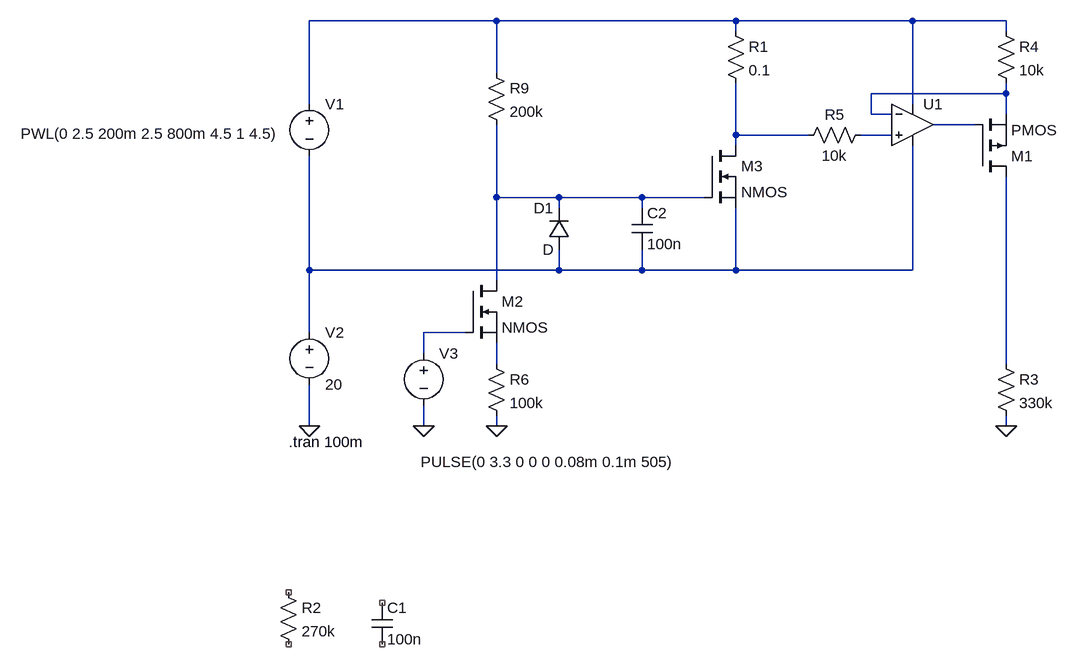
[diagram p0: schematic Balancer_current.asc]
Balancer_current.asc, the LTspice schematic file:
Version 4
SHEET 1 1044 952
WIRE -320 -16 -608 -16
WIRE 48 -16 -320 -16
WIRE 320 -16 48 -16
WIRE 464 -16 320 -16
WIRE 48 0 48 -16
WIRE 464 0 464 -16
WIRE -320 64 -320 -16
WIRE 464 96 464 80
WIRE 464 96 256 96
WIRE -608 112 -608 -16
WIRE 320 112 320 -16
WIRE 256 128 256 96
WIRE 288 128 256 128
WIRE 464 128 464 96
WIRE 416 144 352 144
WIRE 48 160 48 80
WIRE 160 160 48 160
WIRE 288 160 240 160
WIRE 48 176 48 160
WIRE -320 256 -320 144
WIRE -224 256 -320 256
WIRE -96 256 -224 256
WIRE 0 256 -96 256
WIRE -224 272 -224 256
WIRE -96 272 -96 256
WIRE -608 368 -608 192
WIRE -224 368 -224 336
WIRE -224 368 -608 368
WIRE -96 368 -96 336
WIRE -96 368 -224 368
WIRE 48 368 48 272
WIRE 48 368 -96 368
WIRE 320 368 320 176
WIRE 320 368 48 368
WIRE -320 384 -320 256
WIRE -608 464 -608 368
WIRE -368 464 -432 464
WIRE -432 496 -432 464
WIRE -320 512 -320 480
WIRE 464 512 464 224
WIRE -608 608 -608 544
WIRE -432 608 -432 576
WIRE -320 608 -320 592
WIRE 464 608 464 592
FLAG 464 608 0
FLAG -608 608 0
FLAG -320 608 0
FLAG -432 608 0
SYMBOL res 32 -16 R0
SYMATTR InstName R1
SYMATTR Value 0.1
SYMBOL res -656 848 R0
SYMATTR InstName R2
SYMATTR Value 270k
SYMBOL cap -512 880 R0
SYMATTR InstName C1
SYMATTR Value 100n
SYMBOL res 448 496 R0
SYMATTR InstName R3
SYMATTR Value 330k
SYMBOL res 448 -16 R0
SYMATTR InstName R4
SYMATTR Value 10k
SYMBOL OpAmps\\UniversalOpAmp2 320 144 R0
SYMATTR InstName U1
SYMBOL voltage -608 96 R0
WINDOW 3 -444 62 Left 2
WINDOW 123 0 0 Left 0
WINDOW 39 0 0 Left 0
SYMATTR Value PWL(0 2.5 200m 2.5 800m 4.5 1 4.5)
SYMATTR InstName V1
SYMBOL pmos 416 224 M180
SYMATTR InstName M1
SYMBOL voltage -608 448 R0
WINDOW 123 0 0 Left 0
WINDOW 39 0 0 Left 0
SYMATTR InstName V2
SYMATTR Value 20
SYMBOL res 256 144 R90
WINDOW 0 0 56 VBottom 2
WINDOW 3 32 56 VTop 2
SYMATTR InstName R5
SYMATTR Value 10k
SYMBOL cap -112 272 R0
SYMATTR InstName C2
SYMATTR Value 100n
SYMBOL nmos 0 176 R0
SYMATTR InstName M3
SYMBOL diode -208 336 R180
WINDOW 0 24 64 Left 2
WINDOW 3 24 0 Left 2
SYMATTR InstName D1
SYMBOL nmos -368 384 R0
SYMATTR InstName M2
SYMBOL res -336 496 R0
SYMATTR InstName R6
SYMATTR Value 100k
SYMBOL voltage -432 480 R0
WINDOW 3 -5 183 Left 2
WINDOW 123 0 0 Left 0
WINDOW 39 0 0 Left 0
SYMATTR Value PULSE(0 3.3 0 0 0 0.08m 0.1m 505)
SYMATTR InstName V3
SYMBOL res -336 48 R0
SYMATTR InstName R9
SYMATTR Value 200k
TEXT -640 632 Left 2 !.tran 100m

The netlist it stands for:
* Balancer_current.asc
R1 N001 N004 0.1
R2 NC_01 NC_02 270k
C1 NC_03 NC_04 100n
R3 N010 0 330k
R4 N001 N002 10k
XU1 N005 N002 N001 N007 N003 level2 Avol=1Meg GBW=10Meg Slew=10Meg Ilimit=25m Rail=0 Vos=0 En=0 Enk=0 In=0 Ink=0 Rin=500Meg  ; pins In+ In- V+ V- OUT
V1 N001 N007 PWL(0 2.5 200m 2.5 800m 4.5 1 4.5)
M1 N010 N003 N002 N002 PMOS
V2 N007 0 20
R5 N005 N004 10k
C2 N006 N007 100n
M3 N004 N006 N007 N007 NMOS
D1 N007 N006 D
M2 N006 N008 N009 N009 NMOS
R6 N009 0 100k
V3 N008 0 PULSE(0 3.3 0 0 0 0.08m 0.1m 505)
R9 N001 N006 200k
.model D D
.lib standard.dio
.model NMOS NMOS
.model PMOS PMOS
.lib standard.mos
.tran 100m
.lib UniversalOpAmp2.lib
.backanno
.end